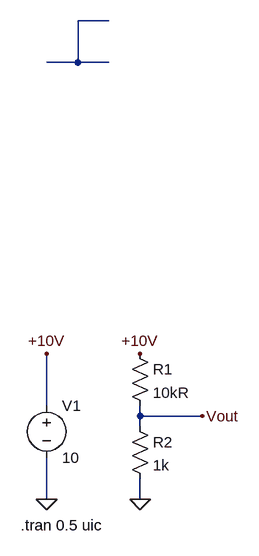
[diagram p0: schematic potenitla divider.asc]
potenitla divider.asc, the LTspice schematic file:
Version 4.1
SHEET 1 880 680
WIRE 192 -512 144 -512
WIRE 144 -448 144 -512
WIRE 144 -448 96 -448
WIRE 192 -448 144 -448
WIRE 96 80 96 0
WIRE 240 96 240 80
WIRE 336 96 240 96
WIRE 240 112 240 96
WIRE 96 224 96 160
WIRE 240 224 240 192
FLAG 96 0 +10V
FLAG 240 0 +10V
FLAG 336 96 Vout
FLAG 240 224 0
FLAG 96 224 0
SYMBOL voltage 96 64 R0
WINDOW 123 0 0 Left 0
WINDOW 39 0 0 Left 0
SYMATTR InstName V1
SYMATTR Value 10
SYMBOL res 224 -16 R0
SYMATTR InstName R1
SYMATTR Value 10kR
SYMBOL res 224 96 R0
SYMATTR InstName R2
SYMATTR Value 1k
TEXT 56 264 Left 2 !.tran 0.5 uic

The netlist it stands for:
* potenitla divider.asc
V1 +10V 0 10
R1 +10V Vout 10kR
R2 Vout 0 1k
.tran 0.5 uic
.backanno
.end